# EasyEDA Pro project FinalUSB.epro

# Schematic Schematic1
Board Name: Board1; Create Date: 2026-07-26; Page Name: P1; Project Name: USB Hub; Schematic Name: Schematic1; Update Date: 2026-07-26; Company: EasyEDA.com; Page Size: A4; Version: V1.0
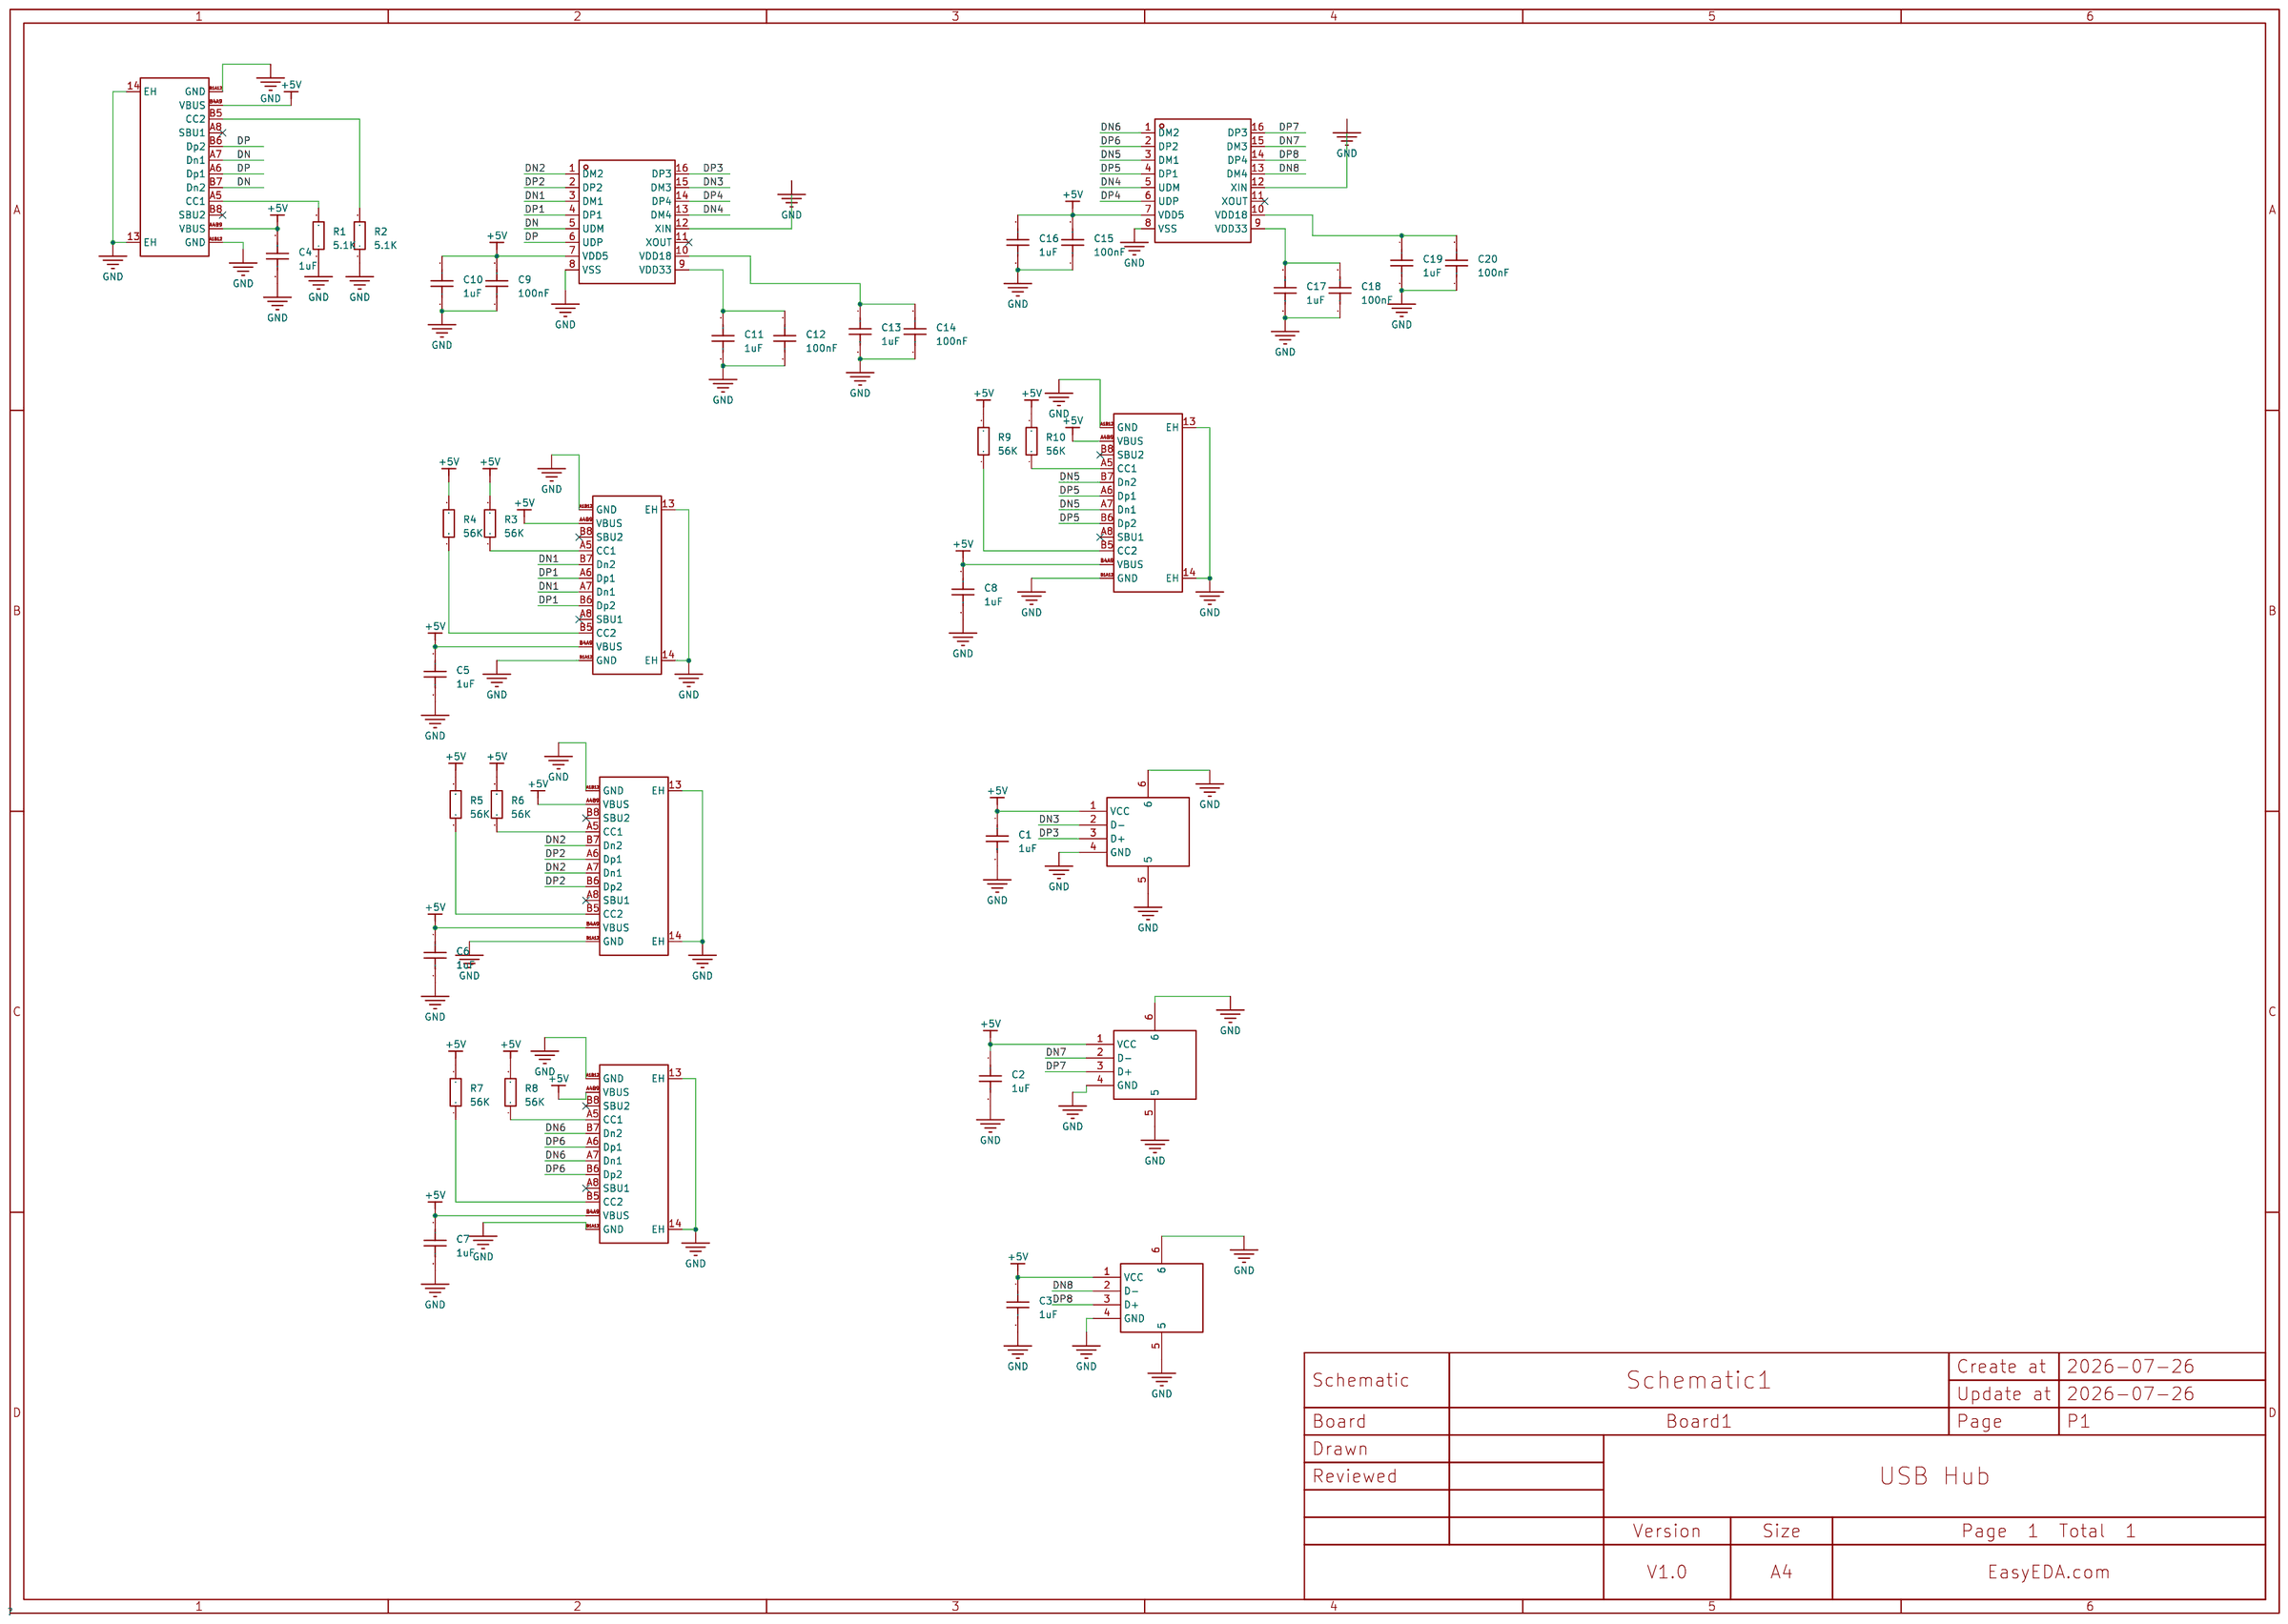
[diagram p0: schematic sheet]

## Parts
C1  1uF  [C0603]
C2  1uF  [C0603]
C3  1uF  [C0603]
C4  1uF  [C0603]
C5  1uF  [C0603]
C6  1uF  [C0603]
C7  1uF  [C0603]
C8  1uF  [C0603]
C9  100nF  [C0603]
C10  1uF  [C0603]
C11  1uF  [C0603]
C12  100nF  [C0603]
C13  1uF  [C0603]
C14  100nF  [C0603]
C15  100nF  [C0603]
C16  1uF  [C0603]
C17  1uF  [C0603]
C18  100nF  [C0603]
C19  1uF  [C0603]
C20  100nF  [C0603]
R1  5.1K  [R0603]
R2  5.1K  [R0603]
R3  56K  [R0603]
R4  56K  [R0603]
R5  56K  [R0603]
R6  56K  [R0603]
R7  56K  [R0603]
R8  56K  [R0603]
R9  56K  [R0603]
R10  56K  [R0603]
U1  SL2.1s  [SSOP-16_L4.6-W2.6-P0.53-LS4.0-BL]
U2  SL2.1s  [SSOP-16_L4.6-W2.6-P0.53-LS4.0-BL]
USB1  TYPE-C 16PIN 2MD(073)  [USB-C-SMD_TYPE-C-16PIN-2MD-073]
USB2  TYPE-C 16PIN 2MD(073)  [USB-C-SMD_TYPE-C-16PIN-2MD-073]
USB3  TYPE-C 16PIN 2MD(073)  [USB-C-SMD_TYPE-C-16PIN-2MD-073]
USB4  10.0 QHHTZB6.3  [USB-A-TH_10.0QHHTZB6.3]
USB5  TYPE-C 16PIN 2MD(073)  [USB-C-SMD_TYPE-C-16PIN-2MD-073]
USB6  10.0 QHHTZB6.3  [USB-A-TH_10.0QHHTZB6.3]
USB7  TYPE-C 16PIN 2MD(073)  [USB-C-SMD_TYPE-C-16PIN-2MD-073]
USB8  10.0 QHHTZB6.3  [USB-A-TH_10.0QHHTZB6.3]

## Library data of the parts
C1-C20 = CAP_0603: Supplier Footprint: 0603
R1-R10 = Res_0603: Supplier Footprint: 0603
U1 U2 = SL2.1s: type:Hub USB Protocol:USB 2.0 Data Rate:- Voltage - Supply:4V~5.25V Voltage - Supply:4V~5.25V Operating Temperature:0℃~+70℃ Operating Temperature:0℃~+70℃ Memory Interface:- Current - Supply:120mA Quiescent Supply Current:2.5mA Number of Channels:4; LCSC Part Name: USB2.0 HUB控制器集成电路; Supplier Part: C2684433; Manufacturer: CoreChips(和芯润德); Supplier Footprint: SSOP-16; JLCPCB Part Class: Extended Part; Datasheet: https://item.szlcsc.com/datasheet/SL2.1s/2782346.html; Supplier: LCSC; type: Hub; USB Protocol: USB 2.0; Voltage - Supply: 4V~5.25V; Operating Temperature: 0℃~+70℃; Current - Supply: 120mA; Quiescent Supply Current: 2.5mA; Number of Channels: 4
USB1-USB3 USB5 USB7 = TYPE-C 16PIN 2MD(073): Connector Type:Type-C Protocol Standard:- Gender:Female Mounting Type:Surface Mount, Right Angle Number of Contacts:16P Number of Ports:1 Current Rating-Power:3A Voltage Rating:5V Connect-Disconnect Life:10,000 cycles Supplementary Features:- Center Heigh; LCSC Part Name: Type-C 母 卧贴; Supplier Part: C2765186; Manufacturer: SHOU HAN(首韩); Supplier Footprint: SMD; JLCPCB Part Class: Extended Part; Datasheet: https://item.szlcsc.com/datasheet/TYPE-C%252016PIN%25202MD(073)/2901843.html; Supplier: LCSC; Connector Type: Type-C; Gender: Female; Mounting Type: Surface Mount, Right Angle; Number of Contacts: 16P; Number of Ports: 1; Current Rating-Power: 3A; Voltage Rating: 5V; Connect-Disconnect Life: 10,000 cycles; Detection color: Black; Operating Temperature: -25℃~+85℃
USB4 USB6 USB8 = 10.0 QHHTZB6.3: Connector Type:Type-A Protocol Standard:USB 2.0 Gender:Female Mounting Type:Surface Mount, Right Angle Number of Contacts:4P Number of Ports:1 Current Rating-Power:1.5A Voltage Rating:30V Connect-Disconnect Life:5,000 times Supplementary Features:- Center; LCSC Part Name: 壳长10.0mm; Supplier Part: C668591; Manufacturer: SHOU HAN(首韩); Supplier Footprint: SMD; JLCPCB Part Class: Extended Part; Datasheet: https://item.szlcsc.com/datasheet/10.0%2520QHHTZB6.3/698534.html; Supplier: LCSC; Connector Type: Type-A; Protocol Standard: USB 2.0; Gender: Female; Mounting Type: Surface Mount, Right Angle; Number of Contacts: 4P; Number of Ports: 1; Current Rating-Power: 1.5A; Voltage Rating: 30V; Connect-Disconnect Life: 5,000 times; Length: 10mm; Detection color: Black; Operating Temperature: -25℃~+85℃

## Nets
+5V: C1.1 C2.1 C3.1 C4.1 C5.1 C6.1 C7.1 C8.1 C9.2 C10.1 C15.2 C16.1 R3.2 R4.2 R5.2 R6.2 R7.2 R8.2 R9.2 R10.2 U1.7(VDD5) U2.7(VDD5) USB1.A4B9(VBUS) USB1.B4A9(VBUS) USB2.A4B9(VBUS) USB2.B4A9(VBUS) USB3.A4B9(VBUS) USB3.B4A9(VBUS) USB4.1(VCC) USB5.A4B9(VBUS) USB5.B4A9(VBUS) USB6.1(VCC) USB7.A4B9(VBUS) USB7.B4A9(VBUS) USB8.1(VCC)
GND: C1.2 C2.2 C3.2 C4.2 C5.2 C6.2 C7.2 C8.2 C9.1 C10.2 C11.2 C12.1 C13.2 C14.1 C15.1 C16.2 C17.2 C18.1 C19.2 C20.1 R1.1 R2.1 U1.8(VSS) U1.12(XIN) U2.8(VSS) U2.12(XIN) USB1.13(EH) USB1.14(EH) USB1.A1B12(GND) USB1.B1A12(GND) USB2.13(EH) USB2.14(EH) USB2.A1B12(GND) USB2.B1A12(GND) USB3.13(EH) USB3.14(EH) USB3.A1B12(GND) USB3.B1A12(GND) USB4.4(GND) USB4.5 USB4.6 USB5.13(EH) USB5.14(EH) USB5.A1B12(GND) USB5.B1A12(GND) USB6.4(GND) USB6.5 USB6.6 USB7.13(EH) USB7.14(EH) USB7.A1B12(GND) USB7.B1A12(GND) USB8.4(GND) USB8.5 USB8.6
DN: U1.5(UDM) USB5.A7(Dn1) USB5.B7(Dn2)
DN1: U1.3(DM1) USB1.A7(Dn1) USB1.B7(Dn2)
DN2: U1.1(DM2) USB2.A7(Dn1) USB2.B7(Dn2)
DN3: U1.15(DM3) USB6.2(D-)
DN4: U1.13(DM4) U2.5(UDM)
DN5: U2.3(DM1) USB7.A7(Dn1) USB7.B7(Dn2)
DN6: U2.1(DM2) USB3.A7(Dn1) USB3.B7(Dn2)
DN7: U2.15(DM3) USB4.2(D-)
DN8: U2.13(DM4) USB8.2(D-)
DP: U1.6(UDP) USB5.A6(Dp1) USB5.B6(Dp2)
DP1: U1.4(DP1) USB1.A6(Dp1) USB1.B6(Dp2)
DP2: U1.2(DP2) USB2.A6(Dp1) USB2.B6(Dp2)
DP3: U1.16(DP3) USB6.3(D+)
DP4: U1.14(DP4) U2.6(UDP)
DP5: U2.4(DP1) USB7.A6(Dp1) USB7.B6(Dp2)
DP6: U2.2(DP2) USB3.A6(Dp1) USB3.B6(Dp2)
DP7: U2.16(DP3) USB4.3(D+)
DP8: U2.14(DP4) USB8.3(D+)
$1N17: R1.2 USB5.A5(CC1)
$1N18: R2.2 USB5.B5(CC2)
$1N61: R3.1 USB1.A5(CC1)
$1N62: R4.1 USB1.B5(CC2)
$1N71: R6.1 USB2.A5(CC1)
$1N72: R5.1 USB2.B5(CC2)
$1N78: R7.1 USB3.B5(CC2)
$1N79: R8.1 USB3.A5(CC1)
$1N109: R10.1 USB7.A5(CC1)
$1N110: R9.1 USB7.B5(CC2)
$1N143: C11.1 C12.2 U1.9(VDD33)
$1N145: C13.1 C14.2 U1.10(VDD18)
$1N148: C17.1 C18.2 U2.9(VDD33)
$1N150: C19.1 C20.2 U2.10(VDD18)

Not connected (* = marked no-connect by the designer): U1 11(XOUT)*; U2 11(XOUT)*; USB1 A8(SBU1)* B8(SBU2)*; USB2 A8(SBU1)* B8(SBU2)*; USB3 A8(SBU1)* B8(SBU2)*; USB5 A8(SBU1)* B8(SBU2)*; USB7 A8(SBU1)* B8(SBU2)*

# Board PCB1
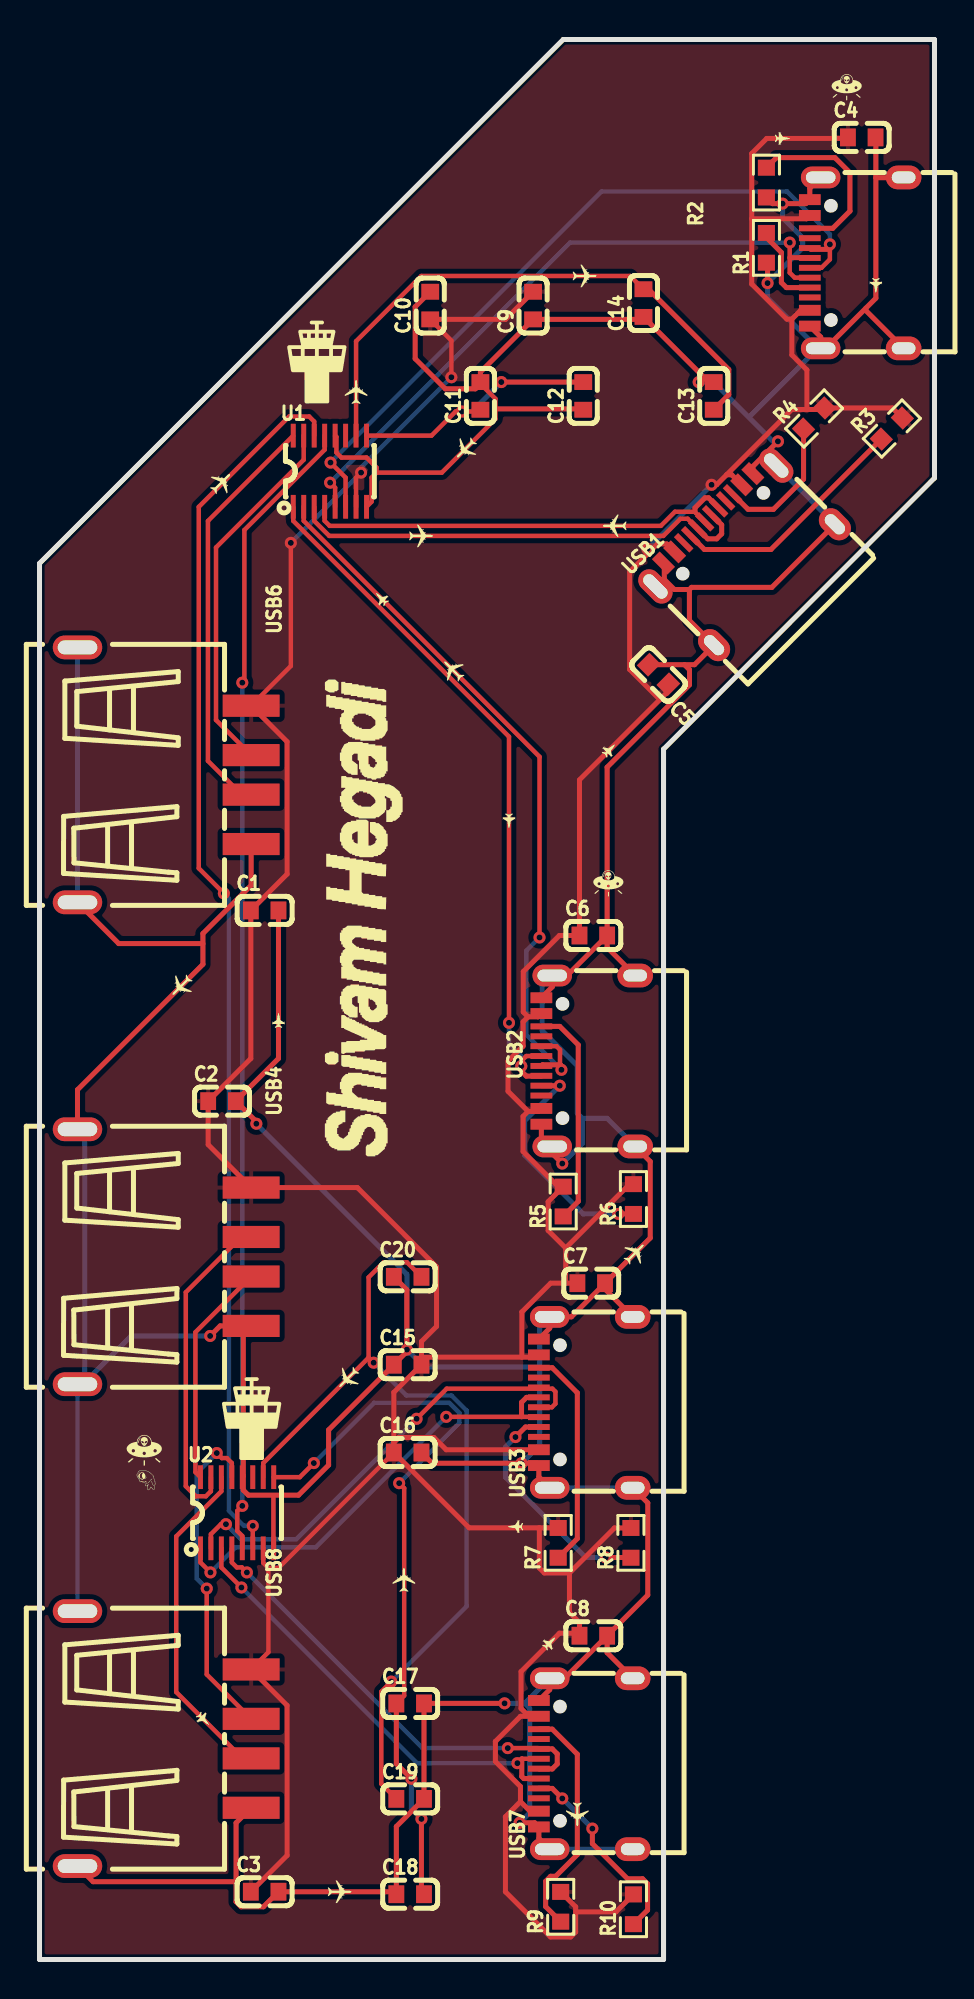
[diagram p1: board, top side]
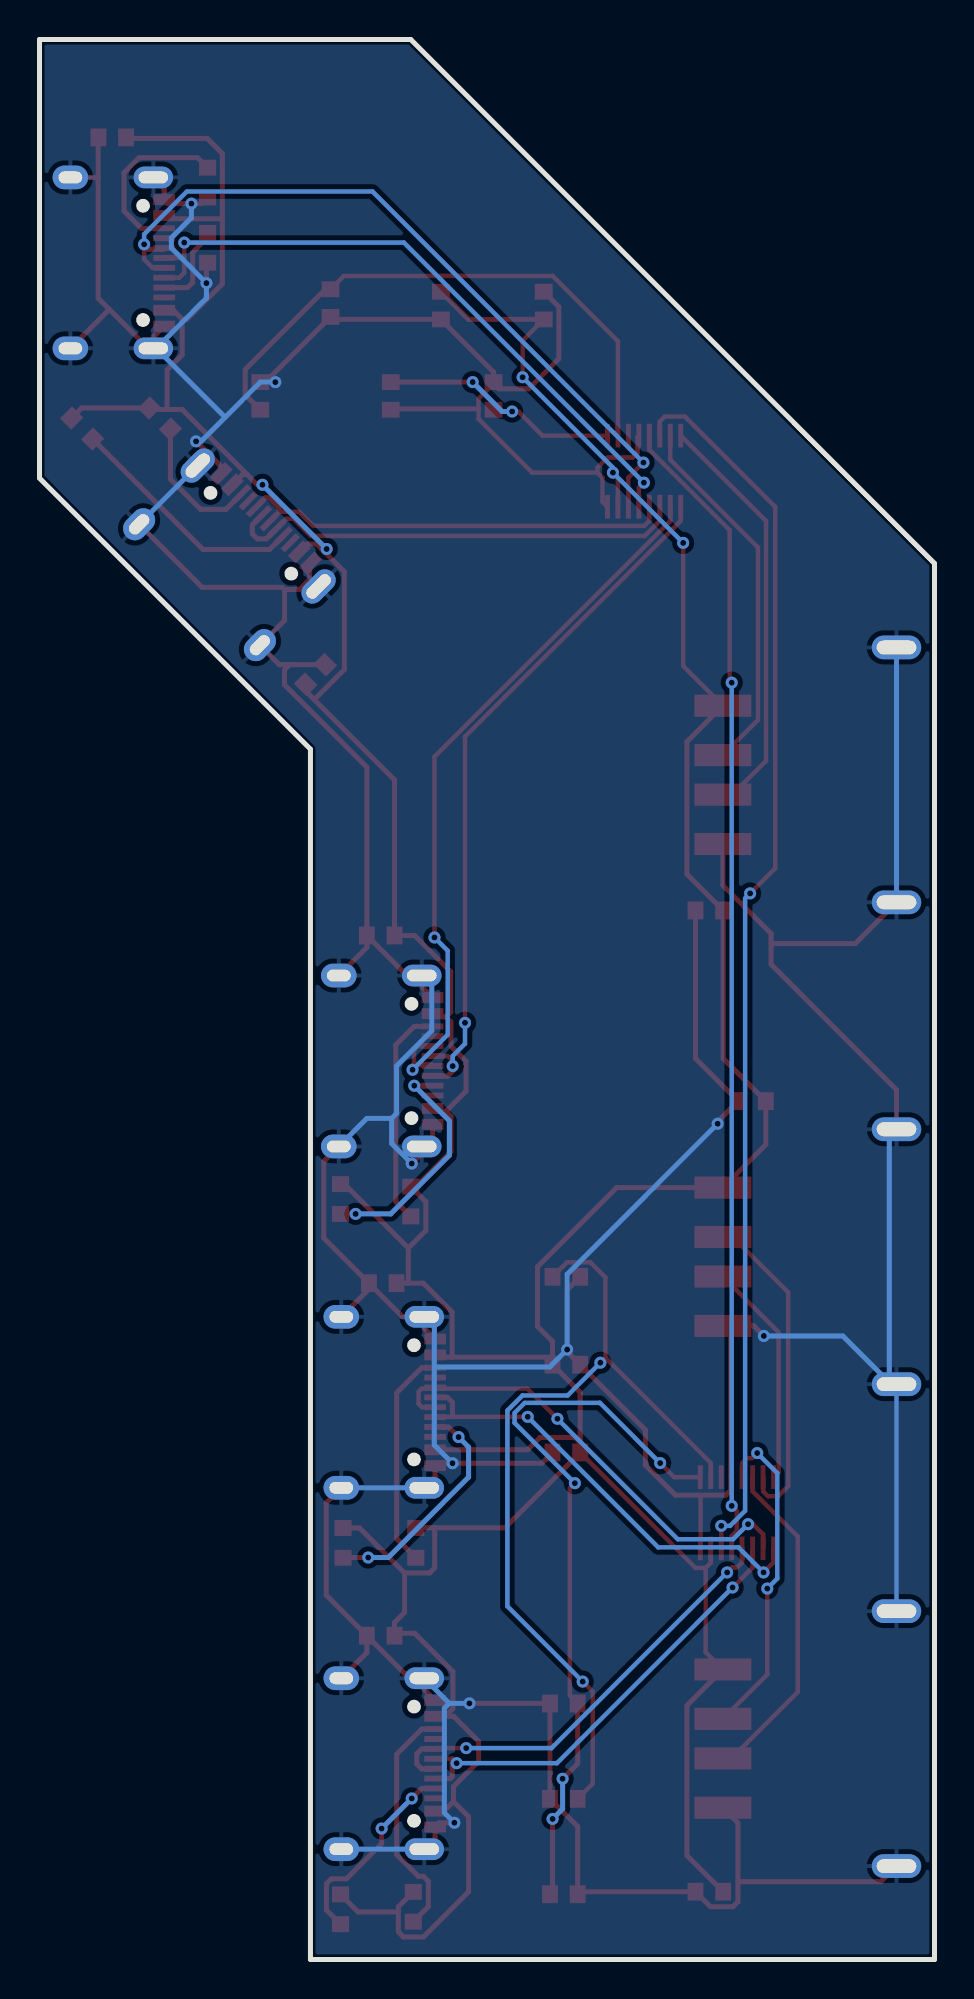
[diagram p2: board, bottom side, seen from below]

Outline 45.31 x 97.16 mm; copper layers: Top Layer, Bottom Layer. Coordinates in mm from the lower left corner of the outline.
Outline path: 0,70.64 26.51,97.16 45.31,97.16 45.31,74.96 31.59,61.25 31.59,0 0,0 0,70.64
Stack: Top Layer 0.035mm / Dielectric1 1.51mm FR4 er 4.5 / Bottom Layer 0.035mm

## Design rules (mm)
spacing copperThickness1oz (default): track to track 0.102, other pairs 0.152 to 0.3
spacing copperThickness2oz: track to track 0.203, other pairs 0.152 to 0.3
track width copperThickness1oz (default): min 0.127, default 0.254, max 2.54
track width copperThickness2oz: min 0.203, default 0.254, max 2.54
differential pair differentialPair (default): width min 0.127, default 0.254, max 2.54; gap min 0.152, default 0.152
net +5V uses copperRegion
net GND uses copperRegion

## Placement (name value [footprint] x y rotation side)
C1  1uF  [C0603]  11.4 53.09 0 top
C2  1uF  [C0603]  9.24 43.43 0 top
C3  1uF  [C0603]  11.4 3.43 0 top
C4  1uF  [C0603]  41.62 92.2 0 top
C5  1uF  [C0603]  31.34 65.02 135 top
C6  1uF  [C0603]  28.03 51.82 0 top
C7  1uF  [C0603]  27.93 34.22 0 top
C8  1uF  [C0603]  28.03 16.38 0 top
C9  100nF  [C0603]  24.99 83.69 90 top
C10  1uF  [C0603]  19.78 83.69 90 top
C11  1uF  [C0603]  22.32 79.12 90 top
C12  100nF  [C0603]  27.53 79.12 90 top
C13  1uF  [C0603]  34.13 79.12 90 top
C14  100nF  [C0603]  30.57 83.82 90 top
C15  100nF  [C0603]  18.64 30.1 0 top
C16  1uF  [C0603]  18.64 25.65 0 top
C17  1uF  [C0603]  18.76 12.95 0 top
C18  100nF  [C0603]  18.76 3.3 0 top
C19  1uF  [C0603]  18.76 8.13 0 top
C20  100nF  [C0603]  18.64 34.54 0 top
R1  5.1K  [R0603]  36.8 86.61 90 top
R2  5.1K  [R0603]  36.8 89.92 90 top
R3  56K  [R0603]  43.15 77.47 45 top
R4  56K  [R0603]  39.21 77.98 45 top
R5  56K  [R0603]  26.51 38.35 90 top
R6  56K  [R0603]  30.07 38.48 90 top
R7  56K  [R0603]  26.26 21.08 90 top
R8  56K  [R0603]  29.94 21.08 90 top
R9  56K  [R0603]  26.38 2.67 90 top
R10  56K  [R0603]  30.07 2.54 90 top
U1  SL2.1s  [SSOP-16_L4.6-W2.6-P0.53-LS4.0-BL]  14.7 75.31 0 top
U2  SL2.1s  [SSOP-16_L4.6-W2.6-P0.53-LS4.0-BL]  10 22.61 0 top
USB1  TYPE-C 16PIN 2MD(073)  [USB-C-SMD_TYPE-C-16PIN-2MD-073#2]  35.53 71.25 45 top
USB2  TYPE-C 16PIN 2MD(073)  [USB-C-SMD_TYPE-C-16PIN-2MD-073]  27.78 45.47 90 top
USB3  TYPE-C 16PIN 2MD(073)  [USB-C-SMD_TYPE-C-16PIN-2MD-073]  27.65 28.19 90 top
USB4  10.0 QHHTZB6.3  [USB-A-TH_10.0QHHTZB6.3]  6.32 35.56 270 top
USB5  TYPE-C 16PIN 2MD(073)  [USB-C-SMD_TYPE-C-16PIN-2MD-073]  41.37 85.85 90 top
USB6  10.0 QHHTZB6.3  [USB-A-TH_10.0QHHTZB6.3]  6.32 59.94 270 top
USB7  TYPE-C 16PIN 2MD(073)  [USB-C-SMD_TYPE-C-16PIN-2MD-073]  27.65 9.91 90 top
USB8  10.0 QHHTZB6.3  [USB-A-TH_10.0QHHTZB6.3]  6.32 11.18 270 top

## Footprints (pads in the part's own frame, mm; a bottom-side part is the same pattern mirrored in y, then rotated)
C0603
  rect 0.8x0.9 smd: 1(-0.7,0) 2(0.7,0)
R0603
  rect 0.806x0.864 smd: 1(-0.753,0) 2(0.753,0)
SSOP-16_L4.6-W2.6-P0.53-LS4.0-BL
  rect 0.25x1.2 smd: 1(-1.855,-1.8) 2(-1.325,-1.8) 3(-0.795,-1.8) 4(-0.265,-1.8) 5(0.265,-1.8) 6(0.795,-1.8) 7(1.325,-1.8) 8(1.855,-1.8) 9(1.855,1.8) 10(1.325,1.8) 11(0.795,1.8) 12(0.265,1.8) 13(-0.265,1.8) 14(-0.795,1.8) 15(-1.325,1.8) 16(-1.855,1.8)
USB-A-TH_10.0QHHTZB6.3
  rect 1.12x2.88 smd: 1(-3.5,4.395) 2(-1,4.395) 3(1,4.395) 4(3.5,4.395)
  oval 1.2x2.5 hole 0.7x2: 5(-6.45,-4.395) 6(6.45,-4.395)
USB-C-SMD_TYPE-C-16PIN-2MD-073
  oval 1.1x2 hole 0.6x1.5: 13(-4.325,1.825) 14(4.325,1.825)
  oval 1.2x1.8 hole 0.6x1.2: 13(-4.325,-2.375) 14(4.325,-2.375)
  rect 0.55x1.1 smd: A1B12(-3.2,2.375) A4B9(-2.4,2.375) B1A12(3.2,2.375) B4A9(2.4,2.375)
  rect 0.3x1.1 smd: A5(-1.25,2.375) A6(-0.25,2.375) A7(0.25,2.375) A8(1.25,2.375) B5(1.75,2.375) B6(0.75,2.375) B7(-0.75,2.375) B8(-1.75,2.375)
USB-C-SMD_TYPE-C-16PIN-2MD-073#2
  oval 1.1x2 hole 0.6x1.5: 13(-4.325,1.825) 14(4.325,1.825)
  oval 1.2x1.8 hole 0.6x1.2: 13(-4.325,-2.375) 14(4.325,-2.375)
  rect 0.55x1.1 smd: A1B12(-3.2,2.375) A4B9(-2.4,2.375) B1A12(3.2,2.375) B4A9(2.4,2.375)
  rect 0.3x1.1 smd: A5(-1.25,2.375) A6(-0.25,2.375) A7(0.25,2.375) A8(1.25,2.375) B5(1.75,2.375) B6(0.75,2.375) B7(-0.75,2.375) B8(-1.75,2.375)

## Nets
As in the schematic.

Pads without a net: U1 11; U2 11; USB1 A8 B8; USB2 A8 B8; USB3 A8 B8; USB5 A8 B8; USB7 A8 B8

## Via types
v1: diameter 0.61, hole 0.305, Top Layer to Bottom Layer, 52 vias

## Routing (per net, layer and track width the routed paths; a pad name or vN(x,y) marks a point on that pad's centre or on a via; arc(x,y) is an arc through that point)
+5V: length 272.5
  Top Layer w0.225: 11.59,19.81 11.33,20.07 U2.7 ; 11.59,19.81 12.09,19.81 C16.1 ; 11.59,19.81 11.59,15.55 USB8.1 ; C10.1 20.85,81.92 v1(20.85,80.07) ; v1(12.72,71.68) 12.72,65.45 USB6.1 ; v1(16.28,75.24) 16.03,74.99 U1.7
  Top Layer w0.254: C5.1 31.83,64.19 31.4,63.75 ; 36.05,88.09 36.05,91.39 36.82,92.15 40.87,92.15 C4.1 ; 36.05,88.09 36.05,84.78 37.83,83.01 38.09,83.01 ; 36.05,88.09 38.83,88.09 USB5.B4A9 ; 24.35,7.99 23.59,7.23 23.59,3.42 25.87,1.14 26.89,1.14 27.14,1.39 27.14,2.66 R9.2 ; 24.35,7.99 24.35,8.75 23.08,10.02 23.08,11.04 24.35,12.31 USB7.B4A9 25.14,12.45 24.63,12.45 24.38,12.7 24.38,14.57 26.32,16.51 27.34,16.51 ; 24.35,7.99 24.83,7.51 USB7.A4B9 ; 25.3,21.84 21.75,21.84 C16.1 17.94,26.16 ; 25.3,21.84 26.25,21.84 R7.2 ; 25.3,21.84 25.3,19.81 25.56,19.56 26.83,19.56 ; 26.83,19.56 26.83,17.56 27.34,17.05 27.34,16.51 ; 26.83,19.56 29.1,21.84 R8.2 ; USB8.1 12.53,12.85 12.53,5.26 C3.1 ; 26.64,34.22 25.87,34.22 24.42,32.77 24.42,30.48 ; 26.64,34.22 26.64,36 ; 26.64,34.22 C7.1 ; 26.64,36 25.75,36.89 25.75,38.35 R5.2 26.26,39.11 24.48,40.89 24.48,42.66 24.73,42.92 ; 26.64,36 29.87,39.23 R6.2 ; 27.34,16.51 C8.1 ; 38.85,78.43 38.85,80.43 38.09,81.2 38.09,83.01 ; 38.85,78.43 38.09,78.43 34.78,75.13 ; 38.85,78.43 39.67,78.43 R4.2 43.17,78.51 R3.2 ; C9.2 23.59,82.99 C10.1 ; 24.73,47.7 25.24,47.7 USB2.B4A9 ; 24.73,47.7 24.48,47.45 24.48,46.22 23.72,45.46 23.72,43.93 24.73,42.92 ; 24.73,47.7 24.49,47.94 24.49,49.99 26.32,51.82 C6.1 27.34,59.69 31.4,63.75 ; 17.94,26.16 17.94,28.7 C15.2 19.34,30.48 ; 17.94,26.16 18.19,26.41 19.97,26.41 20.59,25.79 25.28,25.79 ; USB6.1 12.53,61.62 12.53,54.92 C1.1 10.7,45.59 C2.1 8.54,41.23 USB4.1 16.09,39.06 20.1,35.05 20.1,32.03 19.34,31.27 19.34,30.48 ; 24.73,42.92 25.26,42.92 USB2.A4B9 ; 38.09,83.01 38.53,83.45 USB5.A4B9 ; 24.42,30.48 25.16,30.48 USB3.B4A9 ; 24.42,30.48 19.34,30.48 ; 34.78,75.13 35.04,75.13 35.55,74.62 ; 34.78,75.13 34.28,74.62 v1(34.02,74.62) ; USB1.A4B9 31.75,71.63 31.28,71.63 29.88,70.22 29.88,65.28 31.4,63.75 ; 27.14,2.41 29.18,2.41 R10.2 ; 31.03,71.37 v1(30.77,71.37)
  Bottom Layer w0.225: v1(20.85,80.07) 16.28,75.49 v1(16.28,75.24) v1(12.72,71.68)
  Bottom Layer w0.254: v1(30.77,71.37) v1(34.02,74.62)
GND: length 388.2
  Top Layer w0.225: C11.2 22.32,79.73 23.08,78.97 23.08,77.96 20.37,75.24 17.06,75.24 ; 17.06,75.24 17.06,75.49 16.56,76 15.28,76 15.03,76.26 15.03,77.04 U1.12 ; 17.06,75.24 16.81,74.99 16.81,73.77 U1.8 ; U2.8 11.84,20.82 11.84,23.49 ; 10.32,24.51 10.32,24.46 U2.12
  Top Layer w0.254: C7.2 26.93,32.52 USB3.14 25.83,31.94 USB3.B1A12 ; C7.2 30.92,36.51 30.92,40.38 USB2.13 ; C7.2 28.63,33.92 USB3.14 ; USB3.13 25.28,24.42 25.28,24.99 25.16,25.11 v1(24.4,25.11) 19.88,25.11 C16.2 ; 32.65,65.52 33.16,65.52 USB1.13 32.9,67.76 32.9,69.32 ; 32.65,65.52 32.9,65.27 32.9,64.5 28.74,60.33 C6.2 ; 32.65,65.52 C5.2 ; C20.1 18.6,33.88 v1(18.6,30.86) 18.6,30.76 C15.1 14.63,26.8 14.63,25.02 13.11,23.49 10.57,23.49 10.32,23.75 10.32,31.66 USB4.4 9.15,32.06 v1(8.64,31.55) ; USB5.13 41.83,83.44 41.83,83.56 ; USB2.B1A12 25.96,49.22 25.96,49.79 26.71,49.79 C6.2 ; USB8.4 9.95,6.91 9.95,2.92 10.21,2.67 11.34,2.67 12.1,3.43 ; USB7.B1A12 25.83,13.66 USB7.14 26.58,14.23 C8.2 ; C8.2 30.79,18.44 30.79,23.11 USB3.13 ; C8.2 28.74,15.53 USB7.14 ; v1(10.98,42.29) 10.98,42.4 C2.2 12.1,45.59 12.1,53.09 ; USB5.14 39,89.63 USB5.B1A12 38.79,88.85 v1(37.62,88.85) 37.11,88.85 R2.1 ; C6.2 28.74,51.21 USB2.14 ; 22.32,79.73 22.07,79.48 20.54,79.48 19.02,81 19.02,83.63 C10.2 ; USB1.13 31.53,69.83 31.63,69.83 ; 42.34,90.16 42.34,92.19 C4.2 ; 42.34,90.16 43.73,90.16 USB5.14 ; 42.34,90.16 42.34,84.07 39.8,81.53 USB5.13 39.55,82.1 USB5.A1B12 ; v1(24.31,6.92) 25.07,6.92 USB7.A1B12 25.28,6.13 USB7.13 ; 18.06,3.43 12.1,3.43 ; 18.06,3.43 18.06,3.3 ; 18.06,3.43 18.06,6.73 C19.2 C17.2 ; 23.08,78.46 27.48,78.46 C12.1 ; 36.62,76.06 36.83,76.06 USB1.14 ; v1(23.54,12.96) 19.47,12.96 ; v1(36.86,84.83) 36.86,85.8 R1.1 ; C13.2 33.87,79.82 33.62,80.07 ; 32.9,69.32 33.01,69.43 37.07,69.43 40.27,72.63 ; 32.9,69.32 32.14,69.32 31.63,69.83 ; C11.2 22.32,80.33 C9.1 30.45,82.99 C14.1 33.62,80.07 ; 33.62,80.07 v1(33.37,79.82) ; 31.63,69.83 31.63,70.62 31.59,70.66 ; v1(26.46,40.28) 25.41,41.33 USB2.A1B12 ; v1(37.38,76.82) 36.11,75.55 USB1.B1A12 ; 1.92,53.49 4.01,51.41 8.27,51.41 ; 9.95,3.94 2.71,3.94 USB8.6 ; 25.7,41.04 25.85,41.04 25.96,41.14 ; USB6.4 10.71,54.36 8.27,51.92 8.27,50.36 1.92,44.01 USB4.5
  Bottom Layer w0.225: 1.92,29.11 1.92,17.63
  Bottom Layer w0.254: 35.91,78.04 39.4,81.53 ; 39.4,81.53 USB5.13 ; 39.4,81.53 36.86,84.07 v1(36.86,84.83) 38.63,86.61 38.63,87.11 37.62,88.13 v1(37.62,88.85) ; 27.48,42.56 27.48,41.29 v1(26.46,40.28) ; 27.48,42.56 28.74,42.56 USB2.13 ; 27.48,42.56 27.23,42.82 27.23,45.22 25.45,47 25.45,49.28 25.96,49.79 ; v1(10.98,42.29) 18.6,34.67 v1(18.6,30.86) 19.48,29.98 25.32,29.98 ; v1(33.37,79.82) 34.13,79.82 37.13,76.82 v1(37.38,76.82) ; 1.92,53.49 USB6.5 ; 24.56,12.96 v1(23.54,12.96) ; 24.56,12.96 24.81,12.71 24.81,7.43 v1(24.31,6.92) ; 24.56,12.96 USB7.14 ; USB7.13 USB7.13 ; USB1.14 40.27,72.63 ; v1(24.4,25.11) 25.32,26.03 25.32,32.01 USB3.14 ; v1(8.64,31.55) 4.64,31.55 2.35,29.27 2.08,29.27 1.92,29.11 ; 2.29,29.27 2.29,41.64 USB4.5 ; USB3.13 USB3.13
DN: length 33.3
  Top Layer w0.225: USB5.B7 38.23,85.1 37.98,85.36 v1(37.98,86.88) ; U1.5 14.97,74.48 v1(14.71,74.73)
  Top Layer w0.254: 37.98,86.12 38.98,86.12 USB5.A7
  Bottom Layer w0.225: v1(14.71,74.73) 26.86,86.88 v1(37.98,86.88)
DN1: length 23.7
  Top Layer w0.225: U1.3 13.91,72.8 14.67,72.04 31.58,72.04 32.45,72.9 32.81,72.9 33.32,72.4
  Top Layer w0.254: 33.32,72.4 33.83,71.89 34.28,71.89 34.53,72.14 34.53,72.59 USB1.A7
DN2: length 35.8
  Top Layer w0.225: USB2.A7 24.64,45.72 24.39,45.46 v1(24.39,45.21) ; U1.1 12.84,72.8 23.77,61.88 v1(23.77,47.4)
  Top Layer w0.254: v1(24.39,45.21) 24.39,44.95 24.64,44.7 25.39,44.7 USB2.B7
  Bottom Layer w0.225: v1(24.39,45.21) 24.39,45.72 23.77,46.34 v1(23.77,47.4)
DN3: length 18.7
  Top Layer w0.225: U1.15 13.38,75.89 8.94,71.45 8.94,62.72 USB6.2
DN4: length 58.2
  Top Layer w0.225: v1(10.27,64.61) 10.37,64.71 10.37,72.33 14.44,76.4 U1.13 ; v1(10.27,22.95) 10.01,22.7 10.01,21.68 10.27,21.43 U2.5
  Bottom Layer w0.225: v1(10.27,64.61) v1(10.27,22.95)
DN5: length 23
  Top Layer w0.225: v1(10.22,18.82) 9.21,19.84 U2.3 ; USB7.A7 24.41,10.16 v1(24.19,9.93)
  Top Layer w0.254: USB7.B7 24.52,9.16 24.41,9.26 24.41,10.16
  Bottom Layer w0.225: v1(24.19,9.93) 19.11,9.93 v1(10.22,18.82)
DN6: length 23
  Top Layer w0.225: v1(8.65,19.59) 8.15,20.09 U2.1 ; v1(20.59,27.46) 25.26,27.46 USB3.B7
  Top Layer w0.254: USB3.A7 24.66,28.44 24.4,28.19 24.4,27.46
  Bottom Layer w0.225: v1(20.59,27.46) 13.99,20.86 9.92,20.86 v1(8.65,19.59)
DN7: length 16.6
  Top Layer w0.225: 10.71,36.55 10.2,36.55 7.41,33.76 7.41,23.95 7.91,23.44 8.42,23.44 8.68,23.69 U2.15
DN8: length 16.7
  Top Layer w0.225: USB8.2 8.47,14.42 v1(8.47,18.77) ; 9.74,24.41 9.74,25.12 9.48,25.37 9.23,25.37 v1(8.97,25.63)
  Bottom Layer w0.225: v1(8.97,25.63) 7.96,24.61 7.96,19.28 v1(8.47,18.77)
DP: length 37.9
  Top Layer w0.225: v1(14.73,75.75) 15.5,74.99 U1.6 ; USB5.A6 39.58,85.6 40.01,86.03 v1(40.01,86.79)
  Top Layer w0.254: USB5.B6 39.06,86.54 40.01,86.54
  Bottom Layer w0.225: v1(14.73,75.75) 28.45,89.46 37.85,89.46 40.01,87.3 v1(40.01,86.79)
DP1: length 22.4
  Top Layer w0.225: U1.4 14.44,72.8 14.69,72.54 31.45,72.54 32.17,73.26 33.17,73.26 33.18,73.24 USB1.A6
  Top Layer w0.254: 33.18,73.26 33.18,73.46 33.69,73.96 33.87,73.96 USB1.B6
DP2: length 37.5
  Top Layer w0.225: v1(26.42,45.02) 26.42,45.24 26.38,45.27 26.35,45.27 26.35,46.04 26.17,46.22 USB2.B6 ; U1.2 13.38,72.8 25.31,60.86 v1(25.31,51.72)
  Top Layer w0.254: 26.35,45.27 25.46,45.27 USB2.A6
  Bottom Layer w0.225: v1(25.31,51.72) 24.64,51.05 24.64,46.8 v1(26.42,45.02)
DP3: length 21.1
  Top Layer w0.225: U1.16 8.53,72.79 8.53,60.65 10.23,58.94 USB6.3
DP4: length 62.6
  Top Layer w0.225: v1(9.33,53.95) 8.06,55.22 8.06,73.51 12.63,78.08 13.65,78.08 13.91,77.82 U1.14 ; v1(10.8,21.94) U2.6
  Bottom Layer w0.225: v1(10.8,21.94) 10.35,21.94 9.59,22.71 9.59,53.69 v1(9.33,53.95)
DP5: length 22.8
  Top Layer w0.225: 9.74,20.81 9.74,20.09 9.99,19.84 10.24,19.84 v1(10.5,19.59) ; USB7.B6 25.24,10.7 v1(23.71,10.7)
  Top Layer w0.254: USB7.A6 25.3,9.64 25.96,9.64 26.21,9.89 26.21,10.4 25.96,10.66 USB7.B6
  Bottom Layer w0.225: v1(10.5,19.59) 19.39,10.7 v1(23.71,10.7)
DP6: length 23.5
  Top Layer w0.225: U2.2 8.68,21.52 9.18,22.03 v1(9.44,22.03) ; v1(19.09,27.36) 20.61,28.88 25.96,28.88 26.12,28.73 26.12,28.12 25.94,27.94 USB3.A6
  Top Layer w0.254: 25.35,28.88 USB3.B6
  Bottom Layer w0.225: v1(9.44,22.03) 10.2,21.26 12.99,21.26 v1(19.09,27.36)
DP7: length 11.4
  Top Layer w0.225: USB4.3 7.89,31.74 7.89,24.66 U2.16
DP8: length 17
  Top Layer w0.225: USB8.3 10.66,10.23 10.22,10.23 6.92,13.53 6.92,21.41 9.21,23.69 U2.14
$1N17: length 4.4
  Top Layer w0.254: USB5.A5 37.81,84.6 37.56,84.86 37.56,86.38 36.8,87.14 R1.2
$1N18: length 9.1
  Top Layer w0.254: R2.2 37.31,91.18 40.27,91.18 41.03,90.42 41.03,88.47 40.16,87.6 39,87.6
$1N61: length 12.3
  Top Layer w0.254: R3.1 37.03,71.35 33.66,71.35 USB1.A5
$1N62: length 7.1
  Top Layer w0.254: USB1.B5 35.87,73.38 37.15,73.38 38.68,74.91 R4.1
$1N71: length 11.9
  Top Layer w0.254: v1(29.31,37.73) R6.1 ; USB2.A5 v1(26.34,44.22)
  Bottom Layer w0.254: v1(29.31,37.73) 27.53,37.73 24.56,40.7 24.56,42.44 v1(26.34,44.22)
$1N72: length 11.2
  Top Layer w0.254: R5.1 27.27,38.36 27.27,46.28 26.34,47.22 USB2.B5
$1N78: length 11.2
  Top Layer w0.254: R7.1 27.23,21.3 27.23,28.67 25.96,29.94 USB3.B5
$1N79: length 11.7
  Top Layer w0.254: v1(28.67,20.34) 29.93,20.34 R8.1 ; v1(24.09,26.44) 24.6,26.94 USB3.A5
  Bottom Layer w0.254: v1(24.09,26.44) 23.59,25.93 23.59,24.4 27.65,20.34 v1(28.67,20.34)
$1N109: length 10.3
  Top Layer w0.254: R10.1 30.78,2.5 30.78,3.83 30.53,4.08 29.77,4.08 27.99,5.86 v1(27.99,6.62) ; USB7.A5 25.96,8.66 v1(26.46,8.15)
  Bottom Layer w0.254: v1(26.46,8.15) v1(27.99,6.62)
$1N110: length 12.1
  Top Layer w0.254: USB7.B5 25.96,11.66 27.23,10.39 27.23,5.31 26.13,4.21 25.88,4.21 25.62,3.96 25.62,2.68 R9.1
$1N143: length 13.1
  Top Layer w0.225: C11.1 22.23,78.33 v1(21.38,78.33) 21.06,78.33 19.84,77.11 U1.9
  Top Layer w0.254: v1(23.38,79.82) C12.2
  Bottom Layer w0.254: v1(21.38,78.33) 21.89,78.33 v1(23.38,79.82)
$1N145: length 29.3
  Top Layer w0.225: C14.2 29.91,85.19 19.33,85.19 16.03,81.89 U1.10
  Top Layer w0.254: C13.1 34.89,79.18 34.89,80.46 30.83,84.52 C14.2
$1N148: length 37.6
  Top Layer w0.225: 18.06,12.95 18.46,13.35 18.46,23.85 v1(18.21,24.1) ; v1(13.89,25.12) 13.18,24.41 U2.9
  Top Layer w0.254: C18.2 19.33,3.43 v1(19.33,7.11) ; v1(18.83,9.14) 18.06,9.91 18.06,12.95
  Bottom Layer w0.225: v1(18.21,24.1) 21.25,27.15 21.25,27.66 20.75,28.17 16.94,28.17 v1(13.89,25.12)
  Bottom Layer w0.254: v1(19.33,7.11) 18.83,7.62 v1(18.83,9.14)
$1N150: length 43.4
  Top Layer w0.225: 16.66,30.45 16.66,34.52 17.42,35.28 18.6,35.28 C20.2 ; 16.66,30.45 11.33,25.12 U2.10 ; 16.66,30.45 v1(16.91,30.2) ; v1(17.81,14.06) 17.3,13.55 17.3,8.89 18.06,8.13
  Bottom Layer w0.225: v1(16.91,30.2) 18.57,28.54 20.86,28.54 21.62,27.78 21.62,17.87 v1(17.81,14.06)

## Copper pours and planes (outline as drawn; the poured copper is in the pictures)
+5V on Top Layer: -12.73,110.74 60.17,110.74 60.17,-10.29 -12.73,-10.29
GND on Bottom Layer: -12.86,106.04 62.45,106.04 62.45,-14.22 -12.86,-14.22
